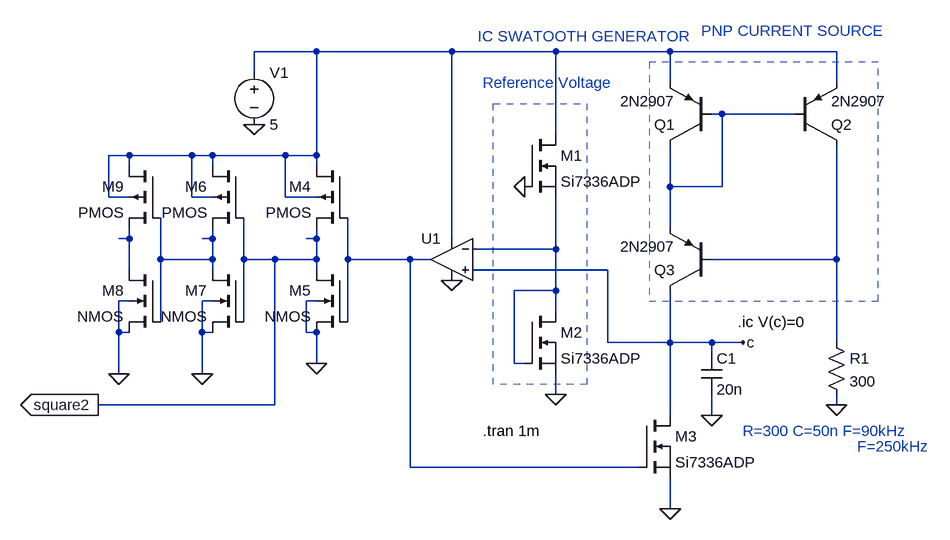
[diagram p0: schematic ICSawtooth.asc]
ICSawtooth.asc, the LTspice schematic file:
Version 4
SHEET 1 880 756
WIRE -352 32 -448 32
WIRE -144 32 -352 32
WIRE 16 32 -144 32
WIRE 192 32 16 32
WIRE 448 32 192 32
WIRE -448 64 -448 32
WIRE 192 80 192 32
WIRE 448 80 448 32
WIRE 272 128 256 128
WIRE 384 128 272 128
WIRE 16 160 16 32
WIRE -640 192 -672 192
WIRE -544 192 -640 192
WIRE -512 192 -544 192
WIRE -400 192 -512 192
WIRE -352 192 -352 32
WIRE -352 192 -400 192
WIRE -640 208 -640 192
WIRE -512 208 -512 192
WIRE -352 208 -352 192
WIRE 192 240 192 176
WIRE 272 240 272 128
WIRE 272 240 192 240
WIRE -672 256 -672 192
WIRE -640 256 -672 256
WIRE -544 256 -544 192
WIRE -512 256 -544 256
WIRE -400 256 -400 192
WIRE -352 256 -400 256
WIRE 192 304 192 240
WIRE -640 320 -640 304
WIRE -640 320 -656 320
WIRE -512 320 -512 304
WIRE -512 320 -528 320
WIRE -352 320 -352 304
WIRE -352 320 -368 320
WIRE -144 320 -144 32
WIRE 16 336 16 256
WIRE 16 336 -112 336
WIRE -592 352 -592 288
WIRE -512 352 -512 320
WIRE -512 352 -592 352
WIRE -464 352 -464 288
WIRE -416 352 -464 352
WIRE -352 352 -352 320
WIRE -352 352 -416 352
WIRE -304 352 -304 288
WIRE -208 352 -304 352
WIRE -176 352 -208 352
WIRE 448 352 448 176
WIRE 448 352 256 352
WIRE -640 368 -640 320
WIRE -512 368 -512 352
WIRE -352 368 -352 352
WIRE 96 368 -112 368
WIRE 16 400 16 336
WIRE 16 400 -48 400
WIRE -640 416 -656 416
WIRE -512 416 -528 416
WIRE -352 416 -368 416
WIRE 16 432 16 400
WIRE -592 448 -592 352
WIRE -464 448 -464 352
WIRE -304 448 -304 352
WIRE -656 464 -656 416
WIRE -640 464 -656 464
WIRE -528 464 -528 416
WIRE -512 464 -528 464
WIRE -368 464 -368 416
WIRE -352 464 -368 464
WIRE 96 480 96 368
WIRE 192 480 192 400
WIRE 192 480 96 480
WIRE 256 480 192 480
WIRE 304 480 256 480
WIRE 448 480 448 352
WIRE 256 496 256 480
WIRE -352 512 -352 464
WIRE -48 512 -48 400
WIRE -32 512 -48 512
WIRE -656 528 -656 464
WIRE -528 528 -528 464
WIRE 16 560 16 528
WIRE -416 576 -416 352
WIRE -416 576 -688 576
WIRE 448 576 448 560
WIRE 192 592 192 480
WIRE 256 592 256 560
WIRE -208 672 -208 352
WIRE 144 672 -208 672
WIRE 192 736 192 688
FLAG -448 144 0
FLAG 256 592 0
FLAG 304 480 c
FLAG 448 576 0
FLAG -32 240 0
FLAG 16 560 0
FLAG -144 384 0
FLAG 192 736 0
FLAG -352 512 0
FLAG -528 528 0
FLAG -688 576 square2
IOPIN -688 576 Out
FLAG -656 528 0
SYMBOL voltage -448 48 R0
SYMATTR InstName V1
SYMATTR Value 5
SYMBOL pnp 256 176 R180
SYMATTR InstName Q1
SYMATTR Value 2N2907
SYMBOL pnp 384 176 M180
SYMATTR InstName Q2
SYMATTR Value 2N2907
SYMBOL pnp 256 400 R180
SYMATTR InstName Q3
SYMATTR Value 2N2907
SYMBOL cap 240 496 R0
SYMATTR InstName C1
SYMATTR Value 20n
SYMBOL res 432 464 R0
SYMATTR InstName R1
SYMATTR Value 300
SYMBOL OpAmps\\UniversalOpamp2 -144 352 M0
SYMATTR InstName U1
SYMBOL nmos -32 160 R0
SYMATTR InstName M1
SYMATTR Value Si7336ADP
SYMBOL nmos -32 432 R0
SYMATTR InstName M2
SYMATTR Value Si7336ADP
SYMBOL nmos 144 592 R0
SYMATTR InstName M3
SYMATTR Value Si7336ADP
SYMBOL nmos4 -304 368 M0
SYMATTR InstName M5
SYMBOL nmos4 -464 368 M0
SYMATTR InstName M7
SYMBOL pmos4 -304 208 M0
SYMATTR InstName M4
SYMBOL pmos4 -464 208 M0
SYMATTR InstName M6
SYMBOL nmos4 -592 368 M0
SYMATTR InstName M8
SYMBOL pmos4 -592 208 M0
SYMATTR InstName M9
TEXT 296 448 Left 2 !.ic V(c)=0
TEXT -96 616 Left 2 !.tran 1m
TEXT 240 0 Left 2 ;PNP CURRENT SOURCE
TEXT -96 80 Left 2 ;Reference Voltage
TEXT -104 8 Left 2 ;IC SWATOOTH GENERATOR
TEXT 304 616 Left 2 ;R=300 C=50n F=90kHz
TEXT 480 640 Left 2 ;F=250kHz
RECTANGLE Normal 512 48 160 416 1
RECTANGLE Normal -80 112 64 544 1

The netlist it stands for:
* ICSawtooth.asc
V1 N001 0 5
Q1 N002 N002 N001 0 2N2907
Q2 N007 N002 N001 0 2N2907
Q3 c N007 N002 0 2N2907
C1 c 0 20n
R1 N007 0 300
XU1 c N005 N001 0 N006 level.2 Avol=1Meg GBW=10Meg Slew=10Meg ilimit=25m rail=0 Vos=0 phimargin=45 en=0 enk=0 in=0 ink=0 Rin=500Meg  ; pins IN+ IN- V+ V- OUT
M1 N001 0 N005 N005 Si7336ADP
M2 N005 N005 0 0 Si7336ADP
M3 c N006 0 0 Si7336ADP
M5 square2 N006 0 0 NMOS
M7 N004 square2 0 0 NMOS
M4 N001 N006 square2 N001 PMOS
M6 N001 square2 N004 N001 PMOS
M8 N003 N004 0 0 NMOS
M9 N001 N004 N003 N001 PMOS
.model NPN NPN
.model PNP PNP
.lib standard.bjt
.model NMOS NMOS
.model PMOS PMOS
.lib standard.mos
.ic V(c)=0
.tran 1m
* PNP CURRENT SOURCE
* Reference Voltage
* IC SWATOOTH GENERATOR
* R=300 C=50n F=90kHz
* F=250kHz
.lib UniversalOpamps2.sub
.backanno
.end